# Altium schematic sheet Low Power Brushed Motor Controller.SchDoc: Low Power Brushed Motor Controller
size B; CheckedBy: Lance Bantoto; Engineer: Kyle Hong; DocumentNumber: 1; Revision: 2; SheetNumber: 1; SheetTotal: 1
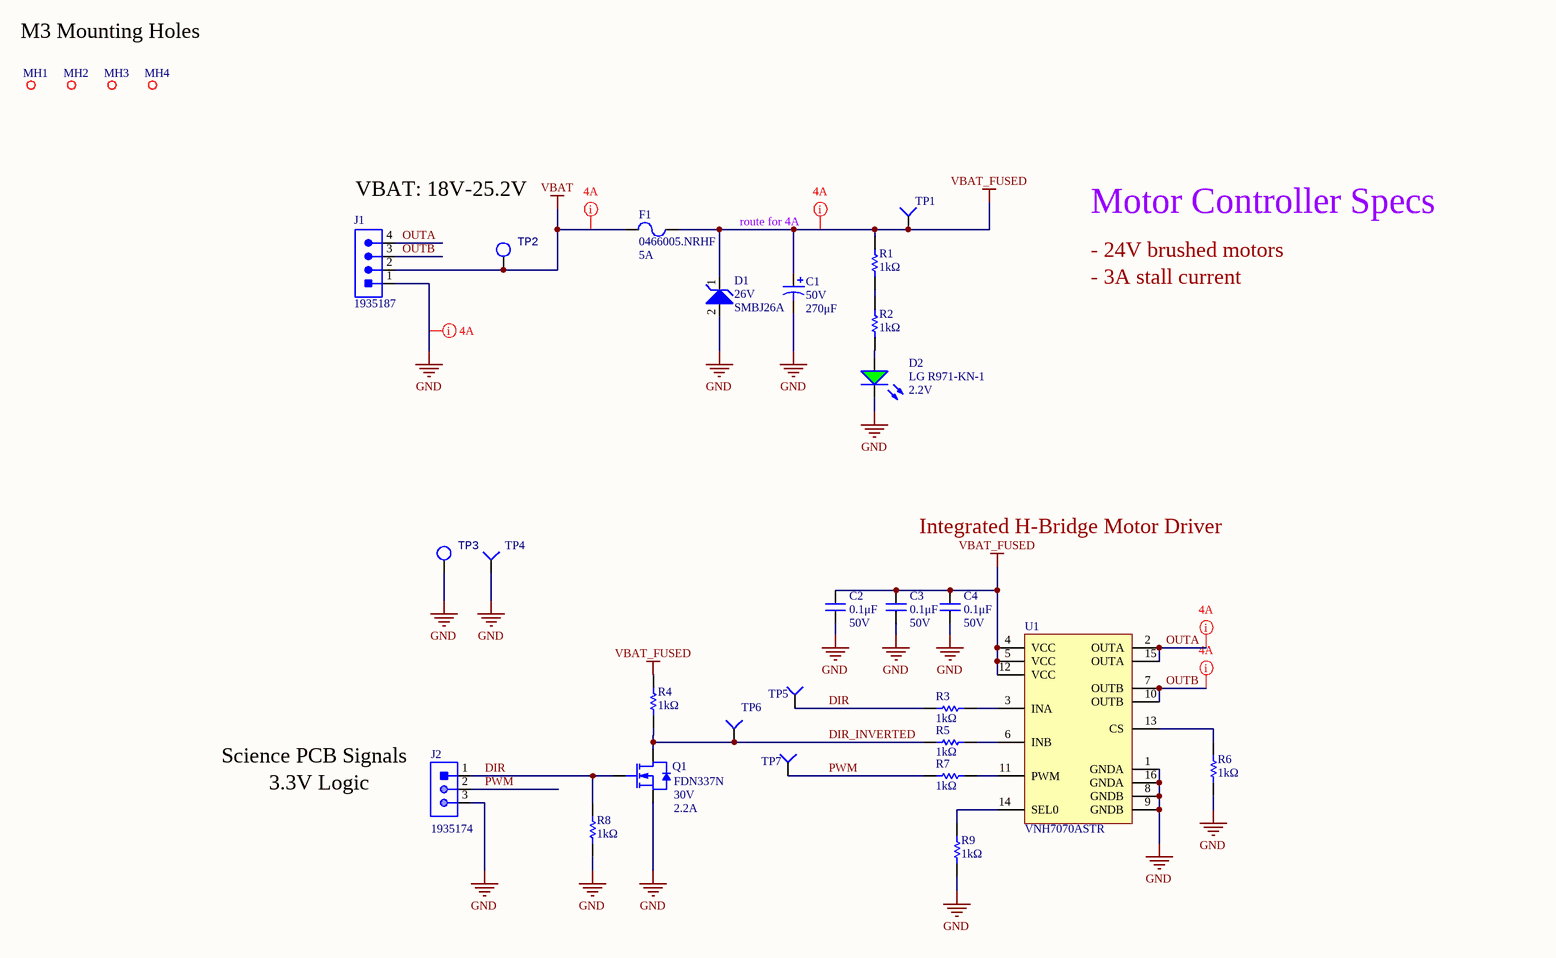
[diagram p0: Low Power Brushed Motor Controller.SchDoc]

## Parts
C1  value 270μF  Voltage Rating: 50V  [RADIAL_PANASONIC_G]  (hidden comment: CAP_270uF_50V_ALUM)
C2  value 0.1μF  Voltage Rating: 50V  [CAP0603]  (hidden comment: CAP_0.1uF_50V_0603)
C3  value 0.1μF  Voltage Rating: 50V  [CAP0603]  (hidden comment: CAP_0.1uF_50V_0603)
C4  value 0.1μF  Voltage Rating: 50V  [CAP0603]  (hidden comment: CAP_0.1uF_50V_0603)
D1  Reverse Standoff Voltage: 26V  Manufacturer Part Number 1: SMBJ26A  [TVS_DIODE_UNIDIRECTIONAL_SMB]  (hidden comment: TVS_DIODE_UNIDIR_26V)
D2  Forward Voltage Drop: 2.2V  Manufacturer Part Number 1: LG R971-KN-1  [LED_0805_GREEN]  (hidden comment: DIO_LED_G)
F1  Manufacturer Part Number 1: 0466005.NRHF  Current Rating: 5A  [FUSE_1206]  (hidden comment: FUSE_5A_1206)
J1  CON_4M_TERM  [1935187]  (value not drawn)
J2  CON_3M_TERM  [1935174]  (value not drawn)
MH1  MOUNTING_HOLE_M3  [MOUNTING_HOLE_3mm]  (value not drawn)  (no BOM)
MH2  MOUNTING_HOLE_M3  [MOUNTING_HOLE_3mm]  (value not drawn)  (no BOM)
MH3  MOUNTING_HOLE_M3  [MOUNTING_HOLE_3mm]  (value not drawn)  (no BOM)
MH4  MOUNTING_HOLE_M3  [MOUNTING_HOLE_3mm]  (value not drawn)  (no BOM)
Q1  Continuous Drain Current (ID): 2.2A  Drain to Source Voltage (Vdss): 30V  Manufacturer Part Number 1: FDN337N  [NMOS_SSOT-3]  (hidden comment: NMOS_30V_2.2A)
R1  value 1kΩ  [RESC0603]  (hidden comment: RES_1kΩ_0603_5%)
R2  value 1kΩ  [RESC0603]  (hidden comment: RES_1kΩ_0603_5%)
R3  value 1kΩ  [RESC0603]  (hidden comment: RES_1kΩ_0603_5%)
R4  value 1kΩ  [RESC0603]  (hidden comment: RES_1kΩ_0603_5%)
R5  value 1kΩ  [RESC0603]  (hidden comment: RES_1kΩ_0603_5%)
R6  value 1kΩ  [RESC0603]  (hidden comment: RES_1kΩ_0603_5%)
R7  value 1kΩ  [RESC0603]  (hidden comment: RES_1kΩ_0603_5%)
R8  value 1kΩ  [RESC0603]  (hidden comment: RES_1kΩ_0603_5%)
R9  value 1kΩ  [RESC0603]  (hidden comment: RES_1kΩ_0603_5%)
TP1  TESTPOINT_1MM_CIRCLE  [TESTPOINT_CIRCLE_1MM]  (value not drawn)  (no BOM)
TP2  TESTPOINT_LOOP  [TESTPOINT_LOOP]  (value not drawn)
TP3  TESTPOINT_LOOP  [TESTPOINT_LOOP]  (value not drawn)
TP4  TESTPOINT_1MM_SQUARE  [TESTPOINT_SQUARE_1MM]  (value not drawn)  (no BOM)
TP5  TESTPOINT_1MM_CIRCLE  [TESTPOINT_CIRCLE_1MM]  (value not drawn)  (no BOM)
TP6  TESTPOINT_1MM_CIRCLE  [TESTPOINT_CIRCLE_1MM]  (value not drawn)  (no BOM)
TP7  TESTPOINT_1MM_CIRCLE  [TESTPOINT_CIRCLE_1MM]  (value not drawn)  (no BOM)
U1  Manufacturer Part Number 1: VNH7070ASTR  [SO-16N]  (hidden comment: IC_MOTOR_DRIVER_ST)

## Nets
GND: C1.2 C2.1 C3.1 C4.2 D1.2(Anode) D2.2(K) J1.1 J2.3 Q1.2(SOURCE) R6.1 R8.1 R9.1 TP3.1 TP4.1(=value) U1.1(GNDA) U1.8(GNDB) U1.9(GNDB) U1.16(GNDA)
VBAT: F1.1 J1.2 TP2.1
VBAT_FUSED: C1.1 C2.2 C3.2 C4.1 D1.1(Cathode) F1.2 R1.2 R4.2 TP1.1(=value) U1.4(VCC) U1.5(VCC) U1.12(VCC)
DIR: J2.1 Q1.1(GATE) R3.1 R8.2 TP5.1(=value)
DIR_INVERTED: Q1.3(DRAIN) R4.1 R5.1 TP6.1(=value)
OUTA: J1.4 U1.2(OUTA) U1.15(OUTA)
OUTB: J1.3 U1.7(OUTB) U1.10(OUTB)
PWM: J2.2 R7.1 TP7.1(=value)
NetD2_1: D2.1(A) R2.1
NetR1_1: R1.1 R2.2
NetR3_2: R3.2 U1.3(INA)
NetR5_2: R5.2 U1.6(INB)
NetR6_2: R6.2 U1.13(CS)
NetR7_2: R7.2 U1.11(PWM)
NetR9_2: R9.2 U1.14(SEL0)

## Layout directives
net class High Current: GND, OUTA, OUTB, VBAT, VBAT_FUSED

## Notes on the sheet
- M3 Mounting Holes
- VBAT: 18V-25.2V
- route for 4A
- Motor Controller Specs
- - 24V brushed motors
- - 3A stall current
- Integrated H-Bridge Motor Driver
- (near J2) Science PCB Signals
- 3.3V Logic
- Title:
- Project:
- Date:
- Rev:
- Reviewer:
- Engineer:
- Sheet:
- of

## Library data of the parts
C1 = CAP_270uF_50V_ALUM: CAP ALUM 270uF 50VDC 20% SMD; Manufacturer 1: Panasonic Electronic Components; Manufacturer Part Number 1: EEE-FN1H271UP; Supplier 1: Digi-Key; Supplier Part Number 1: 10-EEE-FN1H271UPCT-ND; Mounting Type: SMD; Package/Footprint: SMD
C2-C4 = CAP_0.1uF_50V_0603: CAP CER 0.1UF 50V X7R 0603; Manufacturer Part Number 1: CC0603KRX7R9BB104; Manufacturer 1: Yageo; Package/Footprint: 0603; Supplier Part Number 1: 311-1344-1-ND; Supplier 1: Digi-Key; Dielectric: X7R; Temperature Coefficient: X7R; Mounting Type: SMD
D1 = TVS_DIODE_UNIDIR_26V: TVS DIODE 26V 42.1V DO214AA; Manufacturer 1: Littelfuse; Min Breakdown Voltage: 28.9V; Package/Footprint: SMB; Supplier 1: Digi-Key; Clamping Voltage: 42.1V; Supplier Part Number 1: SMBJ26ALFCT-ND; Mounting Type: SMD
D2 = DIO_LED_G: LED GREEN DIFFUSED 0805 SMD; Manufacturer 1: OSRAM; Package/Footprint: 0805; Supplier Part Number 1: 475-1410-1-ND; Supplier 1: Digi-Key; Mounting Type: SMD
F1 = FUSE_5A_1206: FUSE BOARD MNT 5A 32VAC/VDC 1206; Manufacturer 1: Littelfuse; Package/Footprint: 1206; Supplier 1: Digi-Key; Supplier Part Number 1: F6019CT-ND; Current: 5A; Mounting Type: SMD
J1 = CON_4M_TERM: TERM BLK 4POS SIDE ENTRY 5MM PCB; Manufacturer 1: Phoenix Contact; Current: 18A; Voltage: 300V; Wire Gauge: 12-26AWG; Screw Thread: M2.6; Package/Footprint: TH; Manufacturer Part Number 1: 1935187; Supplier Part Number 1: 277-1579-ND; Supplier 1: Digi-Key; Pitch: 5mm; Mounting Type: TH
J2 = CON_3M_TERM: TERM BLK 3POS SIDE ENTRY 5MM; Manufacturer 1: Phoenix Contact; Current Rating: 17.5A; Voltage Rating: 250V; Number of Positions: 3; Max Current Rating: 16A; Number of Levels: 1; Current: 18A; Voltage: 300V; Voltage Rating (DC): 320V; Wire Gauge (Max): 26AWG; Wire Gauge (Min): 12AWG; Approvals: UL,VDE,CB; Package/Footprint: TH; Supplier 1: Digi-Key; Manufacturer Part Number 1: 1935174; Color: Green; Housing Material: Polyamide; Housing Color: Green; Number of Rows: 1; Termination: Solder; Number of Contacts: 3; Orientation: Straight; Number of Circuits: 3; Length: 9mm; Pitch: 5mm; Depth: 9mm; REACH SVHC: Unknown; Flammability Rating: UL94 V-0; Supplier Part Number 1: 277-1578-ND; Category: Terminal Blocks; Number of Pins: 3; Weight: 0.100531oz; Insulation Material: Nylon; Number of Poles: 3; Max Supply Voltage: 250V; Number of Positions Per Level: 3; Height: 11.3mm; Width: 15mm; Wire/Cable Gauge: 26AWG; Stripping Length: 5mm; Material: Nylon; Mounting Type: TH
Q1 = NMOS_30V_2.2A: MOSFET N-CH 30V 2.2A SUPERSOT3; Manufacturer 1: ON Semiconductor / Fairchild; Element Configuration: Single; Drain to Source Resistance: 65mR; Turn-Off Delay Time: 17ns; Gate to Source Voltage (Vgs): 8V; Rise Time: 10ns; Max Power Dissipation: 500mW; Fall Time: 4ns; Input Capacitance: 300pF; Number of Elements: 1; Threshold Voltage: 700mV; Package/Footprint: SuperSOT-3; Supplier Part Number 1: FDN337NCT-ND; Supplier 1: Digi-Key; Category: MOSFETs; Max Operating Temperature: 150°C; Drain to Source Breakdown Voltage: 30V; Power Dissipation: 500mW; Turn-On Delay Time: 4ns; Rds On Max: 65mR; On-State Resistance: 65mR; Voltage Rating (DC): 30V; Current Rating: 2.2A; Dual Supply Voltage: 30V; Nominal Vgs: 700mV; Mounting Type: SMD
R1-R9 = RES_1kΩ_0603_5%: RES 1K OHM 5% 1/10W 0603; Manufacturer 1: Yageo; Manufacturer Part Number 1: RC0603JR-071KL; Package/Footprint: 0603; Tolerance: 5%; Supplier Part Number 1: 311-1.0KGRCT-ND; Supplier 1: Digi-Key; Mounting Type: SMD
TP1 TP5-TP7 = TESTPOINT_1MM_CIRCLE: TESTPOINT 1MM CIRCLE; Part Number (MPN): *
TP2 TP3 = TESTPOINT_LOOP: PC TEST POINT MINIATURE WHITE; Manufacturer 1: Keystone Electronics; Manufacturer Part Number 1: 5002; Package/Footprint: TH; Supplier Part Number 1: 36-5002-ND; Supplier 1: Digi-Key; Mounting Type: TH
TP4 = TESTPOINT_1MM_SQUARE: TESTPOINT 1MM SQUARE; Part Number (MPN): *
U1 = IC_MOTOR_DRIVER_ST: IC MOTOR DRIVER 4V-28V 16SOIC; Manufacturer 1: STMicroelectronics; Output Current: 15A; Package/Footprint: 16-SOIC; Supplier 1: Digi-Key; Supplier Part Number 1: 497-17630-1-ND; Mounting Type: SMD; Verified: Yes